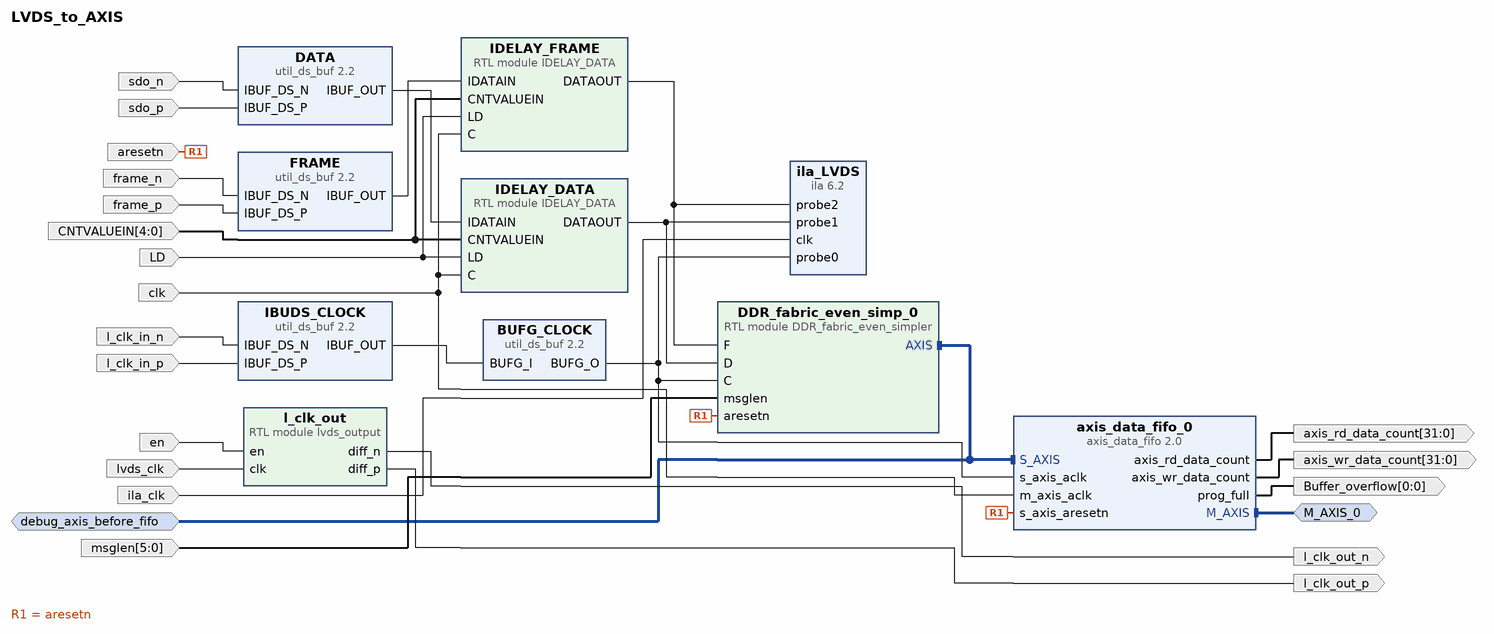
[diagram p0: block diagram of the top level]
# Vivado block design LVDS_to_AXIS, xc7z020clg484-1, Vivado 2024.2
create_bd_design LVDS_to_AXIS

create_bd_intf_port -mode Master -vlnv xilinx.com:interface:axis_rtl:1.0 M_AXIS_0
set_property -dict {CONFIG.FREQ_HZ 50} [get_bd_intf_ports M_AXIS_0]
create_bd_intf_port -mode Monitor -vlnv xilinx.com:interface:axis_rtl:1.0 debug_axis_before_fifo
set_property -dict [list \
  CONFIG.FREQ_HZ 100000000 \
  CONFIG.HAS_TLAST 1 \
  CONFIG.TDATA_NUM_BYTES 8 \
] [get_bd_intf_ports debug_axis_before_fifo]
create_bd_port -dir I -type clk clk
set_property -dict {CONFIG.ASSOCIATED_BUSIF M_AXIS_0 CONFIG.ASSOCIATED_RESET aresetn CONFIG.FREQ_HZ 50} [get_bd_ports clk]
create_bd_port -dir I en
create_bd_port -dir I -type rst aresetn
set_property -dict {CONFIG.POLARITY ACTIVE_LOW} [get_bd_ports aresetn]
create_bd_port -dir I frame_p
create_bd_port -dir I frame_n
create_bd_port -dir I sdo_p
create_bd_port -dir I sdo_n
create_bd_port -dir I -from 5 -to 0 msglen
create_bd_port -dir O l_clk_out_n
create_bd_port -dir O l_clk_out_p
create_bd_port -dir O -from 31 -to 0 axis_wr_data_count
create_bd_port -dir O -from 31 -to 0 axis_rd_data_count
create_bd_port -dir O -from 0 -to 0 Buffer_overflow
create_bd_port -dir I -type clk lvds_clk
set_property -dict {CONFIG.FREQ_HZ 100000000} [get_bd_ports lvds_clk]
create_bd_port -dir I -type clk ila_clk
set_property -dict {CONFIG.FREQ_HZ 200000000 CONFIG.PHASE 0} [get_bd_ports ila_clk]
create_bd_port -dir I -from 4 -to 0 CNTVALUEIN
create_bd_port -dir I LD
create_bd_port -dir I -type clk l_clk_in_p
set_property -dict {CONFIG.FREQ_HZ 100000000} [get_bd_ports l_clk_in_p]
create_bd_port -dir I -type clk l_clk_in_n
set_property -dict {CONFIG.FREQ_HZ 100000000} [get_bd_ports l_clk_in_n]

create_bd_cell -type ip -vlnv xilinx.com:ip:axis_data_fifo:2.0 axis_data_fifo_0
set_property -dict [list \
  CONFIG.FIFO_DEPTH 1024 \
  CONFIG.FIFO_MEMORY_TYPE auto \
  CONFIG.FIFO_MODE 1 \
  CONFIG.HAS_PROG_EMPTY 0 \
  CONFIG.HAS_PROG_FULL 1 \
  CONFIG.HAS_RD_DATA_COUNT 1 \
  CONFIG.HAS_WR_DATA_COUNT 1 \
  CONFIG.IS_ACLK_ASYNC 1 \
  CONFIG.PROG_FULL_THRESH 1000 \
  CONFIG.SYNCHRONIZATION_STAGES 3 \
  CONFIG.TDATA_NUM_BYTES 8 \
] [get_bd_cells axis_data_fifo_0]
create_bd_cell -type module -reference lvds_output l_clk_out
create_bd_cell -type ip -vlnv xilinx.com:ip:util_ds_buf:2.2 FRAME
create_bd_cell -type ip -vlnv xilinx.com:ip:util_ds_buf:2.2 DATA
create_bd_cell -type ip -vlnv xilinx.com:ip:util_ds_buf:2.2 IBUDS_CLOCK
create_bd_cell -type ip -vlnv xilinx.com:ip:util_ds_buf:2.2 BUFG_CLOCK
set_property -dict {CONFIG.C_BUF_TYPE BUFG} [get_bd_cells BUFG_CLOCK]
create_bd_cell -type module -reference IDELAY_DATA IDELAY_DATA
create_bd_cell -type module -reference IDELAY_DATA IDELAY_FRAME
create_bd_cell -type module -reference DDR_fabric_even_simpler DDR_fabric_even_simp_0
set_property -dict {CONFIG.CLOCKRATIO 2} [get_bd_cells DDR_fabric_even_simp_0]
create_bd_cell -type ip -vlnv xilinx.com:ip:ila:6.2 ila_LVDS
set_property -dict [list \
  CONFIG.C_DATA_DEPTH 8192 \
  CONFIG.C_MONITOR_TYPE Native \
  CONFIG.C_NUM_OF_PROBES 3 \
  CONFIG.C_TRIGIN_EN false \
] [get_bd_cells ila_LVDS]

# ---- connections ----

connect_bd_intf_net -intf_net DDR_fabric_0_AXIS [get_bd_intf_pins DDR_fabric_even_simp_0/AXIS] [get_bd_intf_pins axis_data_fifo_0/S_AXIS]
connect_bd_intf_net [get_bd_intf_pins DDR_fabric_even_simp_0/AXIS] [get_bd_intf_ports debug_axis_before_fifo]
connect_bd_intf_net [get_bd_intf_ports M_AXIS_0] [get_bd_intf_pins axis_data_fifo_0/M_AXIS]
connect_bd_net [get_bd_pins DATA/IBUF_OUT] [get_bd_pins IDELAY_DATA/IDATAIN]
connect_bd_net [get_bd_pins FRAME/IBUF_OUT] [get_bd_pins IDELAY_FRAME/IDATAIN]
connect_bd_net [get_bd_pins IDELAY_DATA/DATAOUT] [get_bd_pins ila_LVDS/probe1] [get_bd_pins DDR_fabric_even_simp_0/D]
connect_bd_net [get_bd_pins IDELAY_FRAME/DATAOUT] [get_bd_pins ila_LVDS/probe2] [get_bd_pins DDR_fabric_even_simp_0/F]
connect_bd_net [get_bd_ports CNTVALUEIN] [get_bd_pins IDELAY_DATA/CNTVALUEIN] [get_bd_pins IDELAY_FRAME/CNTVALUEIN]
connect_bd_net [get_bd_ports LD] [get_bd_pins IDELAY_DATA/LD] [get_bd_pins IDELAY_FRAME/LD]
connect_bd_net [get_bd_pins axis_data_fifo_0/axis_rd_data_count] [get_bd_ports axis_rd_data_count]
connect_bd_net [get_bd_pins axis_data_fifo_0/axis_wr_data_count] [get_bd_ports axis_wr_data_count]
connect_bd_net [get_bd_pins axis_data_fifo_0/prog_full] [get_bd_ports Buffer_overflow]
connect_bd_net -net clk_0_1 [get_bd_ports clk] [get_bd_pins axis_data_fifo_0/m_axis_aclk] [get_bd_pins IDELAY_DATA/C] [get_bd_pins IDELAY_FRAME/C]
connect_bd_net -net en_0_1 [get_bd_ports en] [get_bd_pins l_clk_out/en]
connect_bd_net [get_bd_ports frame_n] [get_bd_pins FRAME/IBUF_DS_N]
connect_bd_net [get_bd_ports frame_p] [get_bd_pins FRAME/IBUF_DS_P]
connect_bd_net [get_bd_ports ila_clk] [get_bd_pins ila_LVDS/clk]
connect_bd_net [get_bd_ports l_clk_in_n] [get_bd_pins IBUDS_CLOCK/IBUF_DS_N]
connect_bd_net [get_bd_ports l_clk_in_p] [get_bd_pins IBUDS_CLOCK/IBUF_DS_P]
connect_bd_net [get_bd_ports lvds_clk] [get_bd_pins l_clk_out/clk]
connect_bd_net -net lvds_output_0_l_clk_out_n [get_bd_pins l_clk_out/diff_n] [get_bd_ports l_clk_out_n]
connect_bd_net -net lvds_output_0_l_clk_out_p [get_bd_pins l_clk_out/diff_p] [get_bd_ports l_clk_out_p]
connect_bd_net [get_bd_ports msglen] [get_bd_pins DDR_fabric_even_simp_0/msglen]
connect_bd_net -net proc_sys_reset_0_peripheral_aresetn [get_bd_ports aresetn] \
  [get_bd_pins axis_data_fifo_0/s_axis_aresetn] [get_bd_pins DDR_fabric_even_simp_0/aresetn]
connect_bd_net [get_bd_ports sdo_n] [get_bd_pins DATA/IBUF_DS_N]
connect_bd_net [get_bd_ports sdo_p] [get_bd_pins DATA/IBUF_DS_P]
connect_bd_net -net util_ds_buf_0_BUFG_O [get_bd_pins BUFG_CLOCK/BUFG_O] \
  [get_bd_pins axis_data_fifo_0/s_axis_aclk] [get_bd_pins ila_LVDS/probe0] [get_bd_pins DDR_fabric_even_simp_0/C]
connect_bd_net -net util_ds_buf_1_IBUF_OUT [get_bd_pins IBUDS_CLOCK/IBUF_OUT] [get_bd_pins BUFG_CLOCK/BUFG_I]

validate_bd_design
save_bd_design
